# EAGLE design MSP430 Programmer [QFP16] (EAGLE 6.2)
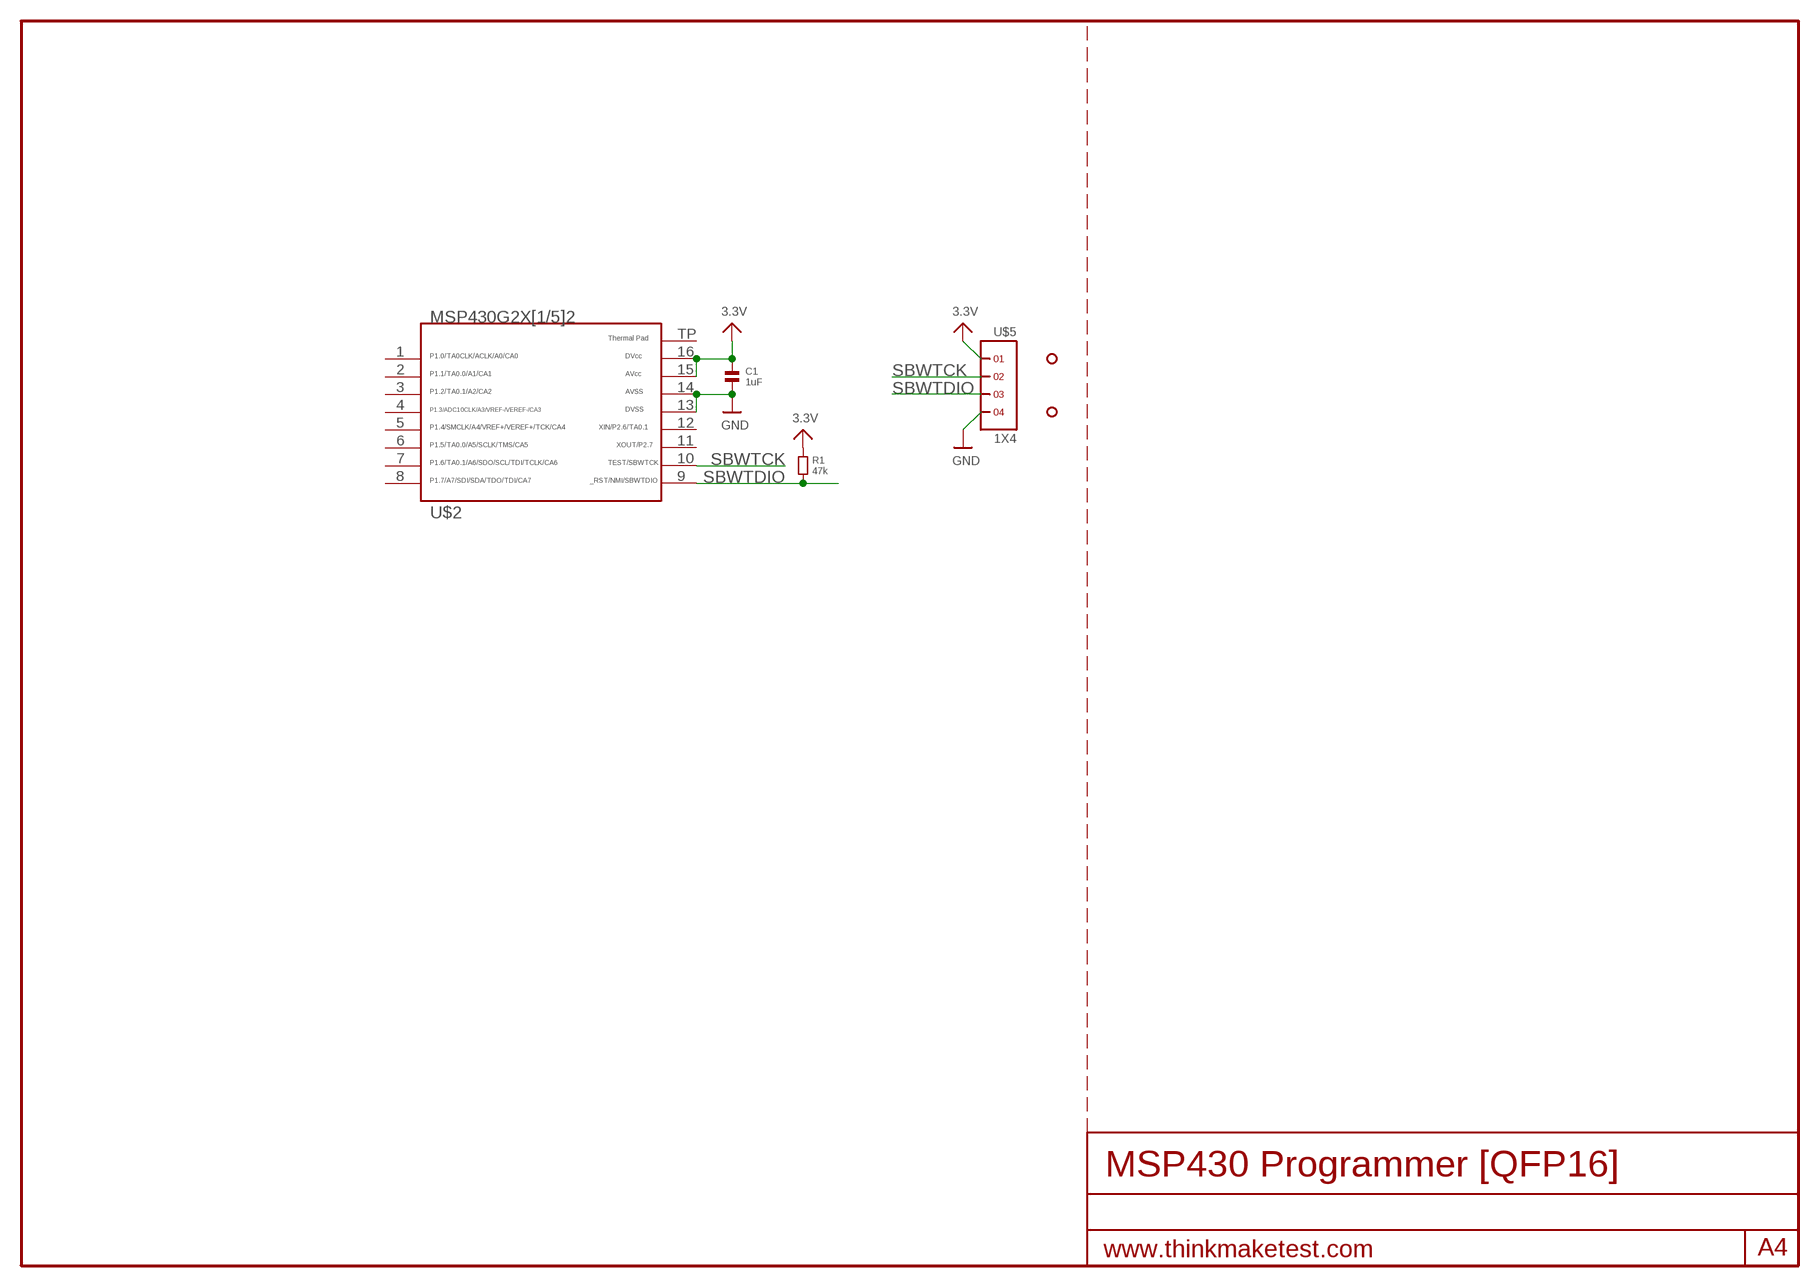
[diagram p0: schematic, sheet 1]

## Parts
C1  1uF  CAPACITOR.0805  [0805]
R1  47k  RESISTOR.0805  [0805]
U$2  G2X[1/5]2---RSA16  [RSA16]
U$5  1X4  [1X4]
U$7  HOLE.2MM  [2MM]
U$8  HOLE.2MM  [2MM]

## Nets
3.3V: C1.1 R1.1 U$2.15 U$2.16 U$5.1
GND: C1.2 U$2.13 U$2.14 U$5.4
SBWTCK: U$2.10 U$5.2
SBWTDIO: R1.2 U$2.9 U$5.3
Unconnected: U$2.1 U$2.2 U$2.3 U$2.4 U$2.5 U$2.6 U$2.7 U$2.8 U$2.11 U$2.12 U$2.TP

## Library data of the parts
C1 = .standardparts:CAPACITOR
R1 = .standardparts:RESISTOR
U$2 = TI_MSP430_v16:G2X[1/5]2---RSA16: MSP430G2X[1/5]2 MSP430G2x52, MSP430G2x12 QFN (RSA) 16 Pin Package http://focus.ti.com/docs/prod/folders/print/msp430g2452.html
U$5 = .headers(.5in):1X4
U$7 U$8 = .stdscrewholes:HOLE

## Board
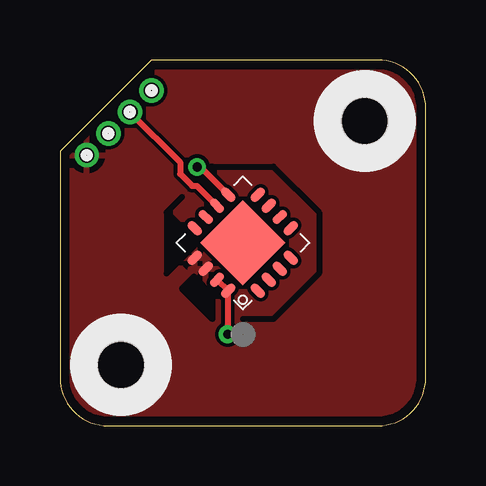
[diagram p1: board, top side]
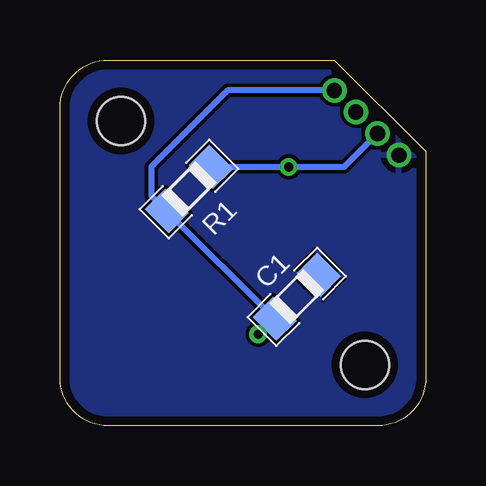
[diagram p2: board, bottom side, seen from below]

Size 15.24 x 15.24 mm. Coordinates in mm from the lower left corner, seen from the top.
Outline: 0,11.43 0,2 arc90 2,0 13.24,0 arc90 15.24,2 15.24,13.24 arc90 13.24,15.24 3.81,15.24 0,11.43
Copper layers (1*16): Top 0.0356mm / dielectric 1.5011mm / Bottom 0.0356mm
Design rules: minimum track width 6mil, minimum drill 13mil, track to track 6mil, track to pad 6mil, pad to pad 6mil, via to via 6mil, smd to smd 6mil, copper to edge 15mil, drill to drill 6mil, minimum pad ring 7mil, minimum via ring 7mil, stop-mask expansion 4mil, vias tented up to drill 16mil, thermal gap 10mil
tRestrict: 13 lines

### Footprints (pad centres in the part's own frame; a part is rotated, then mirrored left to right if it is on the bottom)
0805 = smd 1.2 x 1.4: 1 -1.3,0; 2 1.3,0
RSA16 = smd 0.7 x 0.35: 1 -1.85,0.975; 2 -1.85,0.325; 3 -1.85,-0.325; 4 -1.85,-0.975; 9 1.85,-0.975; 10 1.85,-0.325; 11 1.85,0.325; 12 1.85,0.975 | smd 0.35 x 0.7: 5 -0.975,-1.85; 6 -0.325,-1.85; 7 0.325,-1.85; 8 0.975,-1.85; 13 0.975,1.85; 14 0.325,1.85; 15 -0.325,1.85; 16 -0.975,1.85 | smd 2.5 x 2.5: TP 0,0
1X4 = drill 0.635 pad 1.016: 1 0,0; 2 1.27,0; 3 2.54,0; 4 3.81,0
2MM = hole 2: 0,0

### Placement (x,y rotation side)
C1  5.37,5.37 45 bottom
R1  9.87,9.87 45 bottom
U$2  7.62,7.62 135 top
U$5  3.81,13.97 225 top
U$7  12.7,12.7 0 top
U$8  2.54,2.54 0 top

### Tracks (layer width: path | path; a pad name or v marks a point on that pad's centre or on a via)
3.3V  (via drill 0.38)
  Top 0.254: U$2.15 | U$2.15 U$2.16 6.99,5.61 v6.99,3.81
  Bottom 0.254: v6.99,3.81 6.94,3.81 C1.1 R1.1 11.43,9.59 11.43,10.79 8.26,13.97 U$5.1
GND
  pour Bottom: 0,11.43 0,2 arc90 2,0 13.24,0 arc90 15.24,2 15.24,15.24 3.81,15.24
  pour Top: 15.24,15.24 15.24,2 arc-90 13.24,0 2,0 arc-90 0,2 0,11.43 3.81,15.24
SBWTCK
  Top 0.254: U$5.2 5,10.98 5,10.5 5.5,10 5.7,10 U$2.10
SBWTDIO  (via drill 0.38)
  Top 0.254: U$2.9 5.83,10.78 v5.71,10.78
  Bottom 0.254: R1.2 v5.71,10.78 5.08,10.78 3.4,10.78 U$5.3

### Text on the board
tDocu: 3.6v | SBWTDIO | GND | SBWTCK | Cruz Monrreal II | MSP430 QFP16 PGMR